# Altium project MB1404.PrjPcb (part 4 of 4)

## Sheet STLINK-V3EC.SchDoc: STLINK-V3EC
size A3; Date: Not used; ApprovedBy: Not used; CheckedBy: Not used; Author: Not used; CompanyName: STMicroelectronics; DrawnBy: Not used; Engineer: Not used; Organization: Not used; Address1: Not used; Address2: Not used; Address3: Not used; Address4: Not used; DocumentNumber: Not used; Revision: Not used; SheetNumber: 9; SheetTotal: 9; CurrentTime: Not used; CurrentDate: Not used; Time: Not used; DocumentFullPathAndName: Not used; DocumentName: Not used; ModifiedDate: Not used; ImagePath: Not used; ProjectName: Not used; Application_BuildNumber: Not used
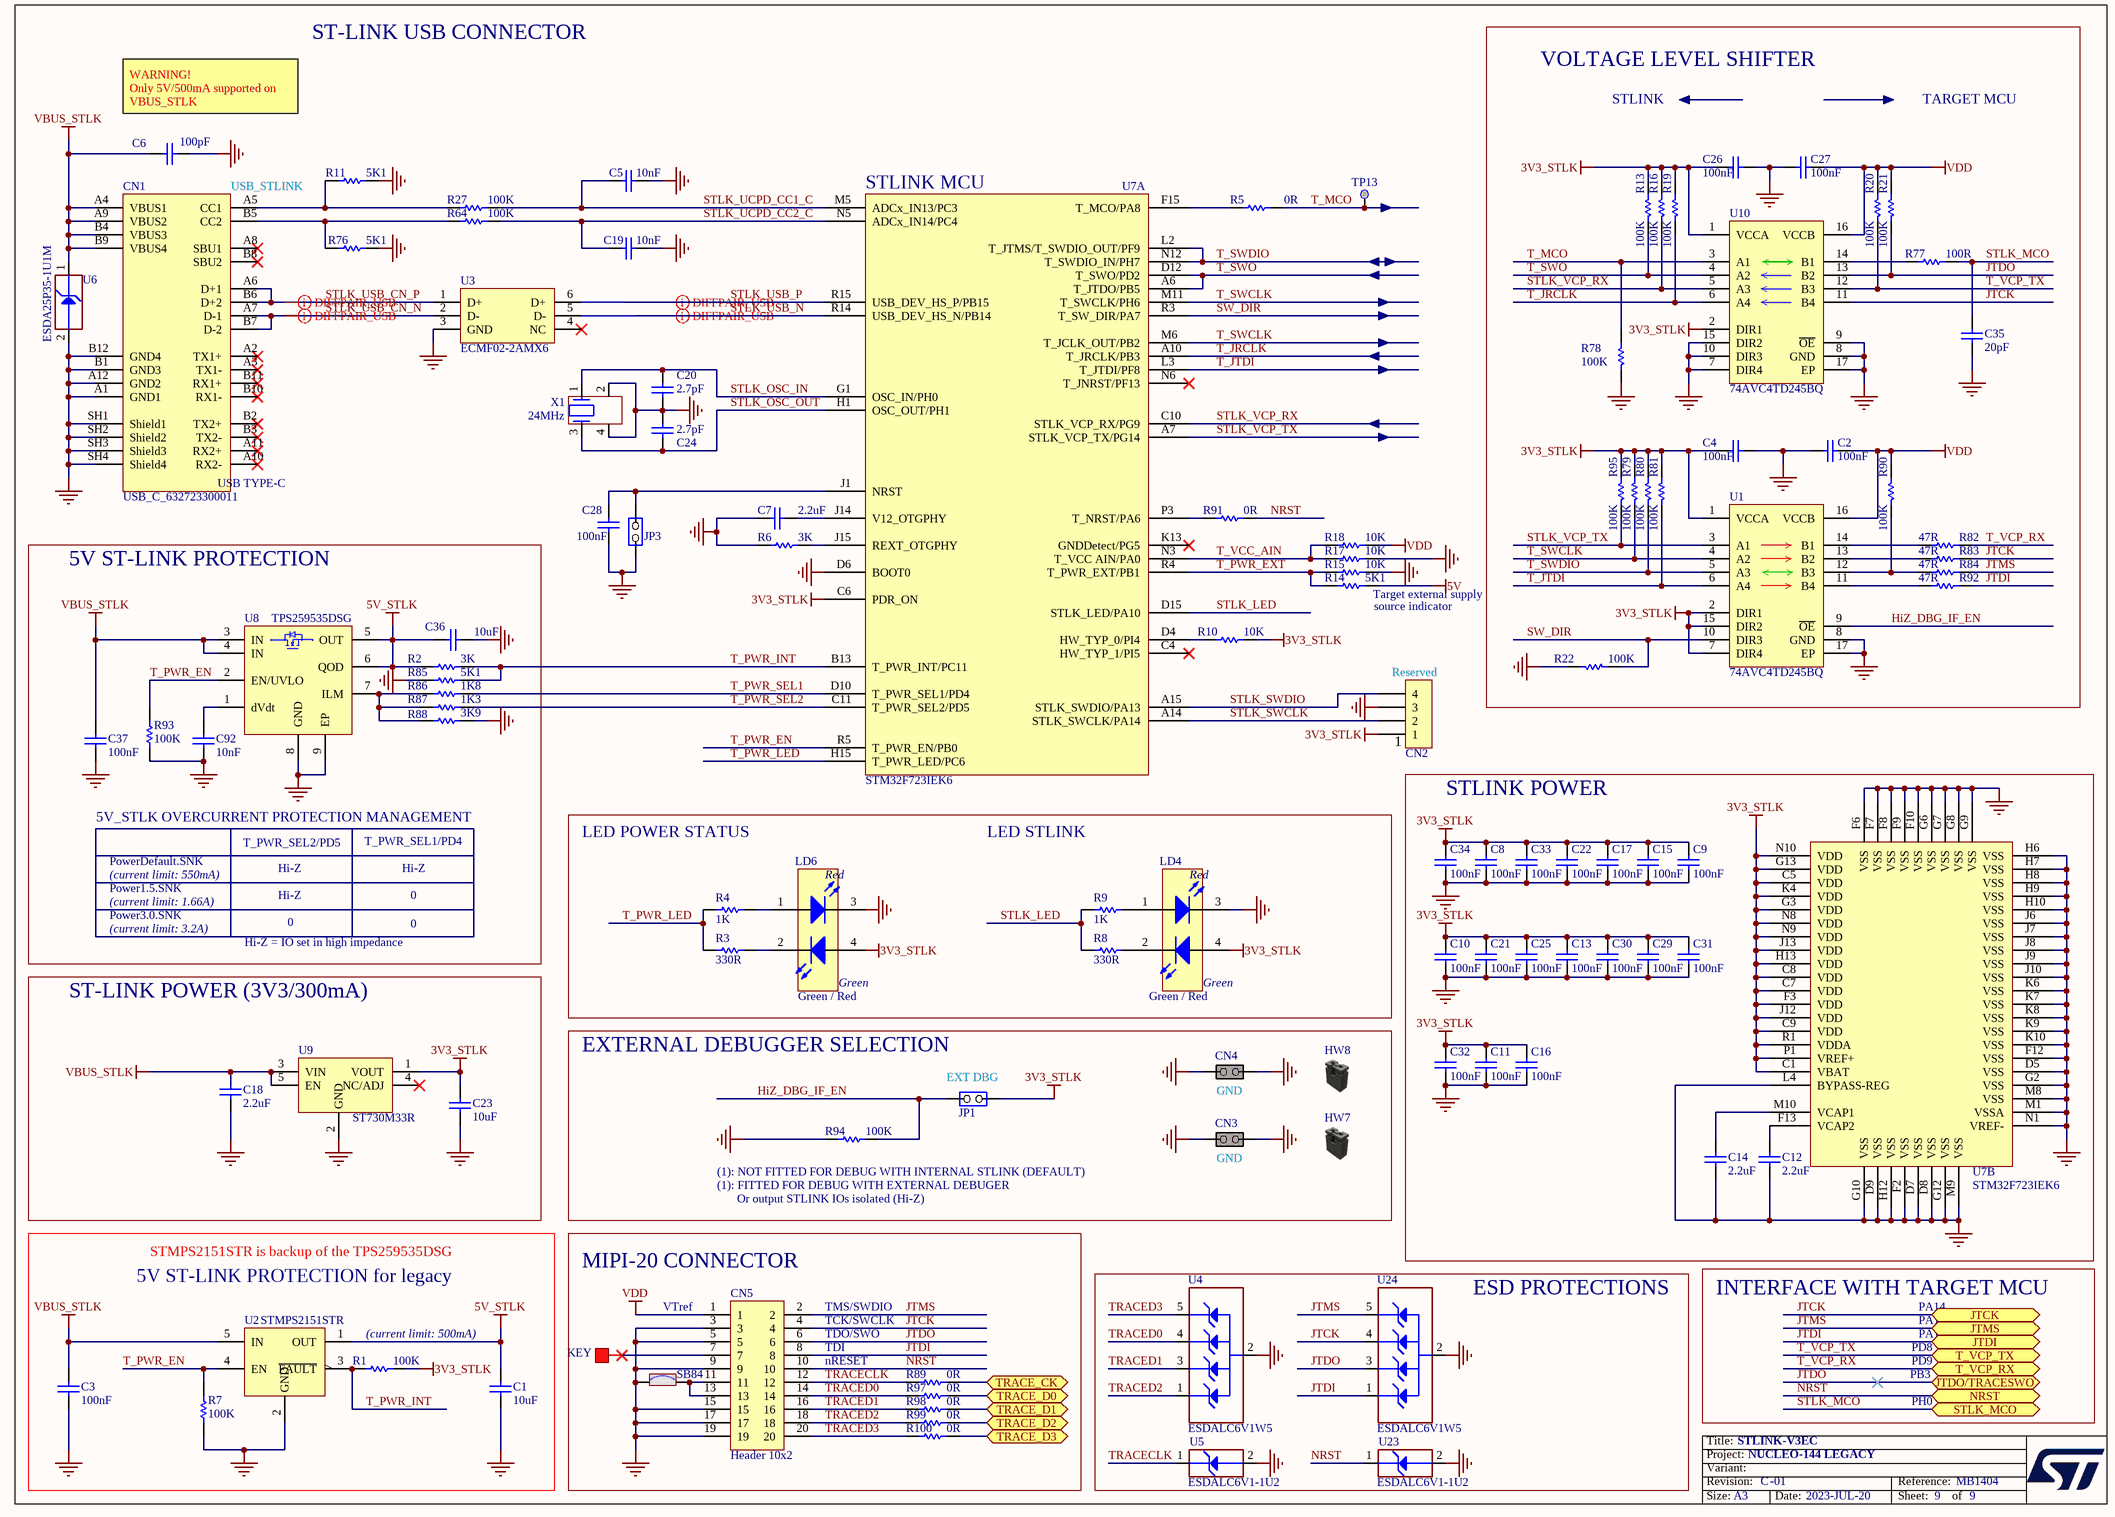
[diagram p8: STLINK-V3EC.SchDoc]

### Parts
C1  value 10uF  [C0603]  (hidden comment: Capacitor)
C2  value 100nF  [C0402]  (hidden comment: Capacitor)
C3  value 100nF  [C0402]  (hidden comment: Capacitor)
C4  value 100nF  [C0402]  (hidden comment: Capacitor)
C5  value 10nF  [C0402]  (hidden comment: Capacitor)
C6  value 100pF  [C0402]  (hidden comment: Capacitor)
C7  value 2.2uF  [C0402]  (hidden comment: Capacitor)
C8  value 100nF  [C0402]  (hidden comment: Capacitor)
C9  value 100nF  [C0402]  (hidden comment: Capacitor)
C10  value 100nF  [C0402]  (hidden comment: Capacitor)
C11  value 100nF  [C0402]  (hidden comment: Capacitor)
C12  value 2.2uF  [C0402]  (hidden comment: Capacitor)
C13  value 100nF  [C0402]  (hidden comment: Capacitor)
C14  value 2.2uF  [C0402]  (hidden comment: Capacitor)
C15  value 100nF  [C0402]  (hidden comment: Capacitor)
C16  value 100nF  [C0402]  (hidden comment: Capacitor)
C17  value 100nF  [C0402]  (hidden comment: Capacitor)
C18  value 2.2uF  [C0805]  (hidden comment: Capacitor)
C19  value 10nF  [C0402]  (hidden comment: Capacitor)
C20  value 2.7pF  [C0402]  (hidden comment: Capacitor)
C21  value 100nF  [C0402]  (hidden comment: Capacitor)
C22  value 100nF  [C0402]  (hidden comment: Capacitor)
C23  value 10uF  [C0603]  (hidden comment: Capacitor)
C24  value 2.7pF  [C0402]  (hidden comment: Capacitor)
C25  value 100nF  [C0402]  (hidden comment: Capacitor)
C26  value 100nF  [C0402]  (hidden comment: Capacitor)
C27  value 100nF  [C0402]  (hidden comment: Capacitor)
C28  value 100nF  [C0402]  (hidden comment: Capacitor)
C29  value 100nF  [C0402]  (hidden comment: Capacitor)
C30  value 100nF  [C0402]  (hidden comment: Capacitor)
C31  value 100nF  [C0402]  (hidden comment: Capacitor)
C32  value 100nF  [C0402]  (hidden comment: Capacitor)
C33  value 100nF  [C0402]  (hidden comment: Capacitor)
C34  value 100nF  [C0402]  (hidden comment: Capacitor)
C35  value 20pF  [C0402]  (hidden comment: Capacitor)
C36  value 10uF  [C0603]  (hidden comment: Capacitor)
C37  value 100nF  [C0402]  (hidden comment: Capacitor)
C92  value 10nF  [C0402]  (hidden comment: Capacitor)
CN1  value USB_C_632723300011  [CON_USB-TYPEC_WE_632723300011]  (hidden comment: USB_TYPE_C_Receptacle)
CN2  Header 4x1  [CON_SAMTEC_TSW-104-07-G-S]  (value not drawn)
CN3  Jumper_Header 2x1  [CON_SAMTEC_TSW-102-09-X-S]  (value not drawn)
CN4  Jumper_Header 2x1  [CON_SAMTEC_TSW-102-09-X-S]  (value not drawn)
CN5  Header 10x2  [CON_SAMTEC_FTSH-110-01-L-DV]
HW7  Shunt Black 2.54mm  (value not drawn)  (mechanical)
HW8  Shunt Black 2.54mm  (value not drawn)  (mechanical)
JP1  Jumper_Header 2x1  [CON_SAMTEC_TSW-102-07-G-S]  (value not drawn)
JP3  Jumper_Header 2x1  [CON_SAMTEC_TSW-102-07-G-S]  (value not drawn)
LD4  value Green / Red  [LED_BI-GR_WE-150141SV73110]  (hidden comment: LED_BICOLOR)
LD6  value Green / Red  [LED_BI-GR_WE-150141SV73110]  (hidden comment: LED_BICOLOR)
R1  value 100K  [R0402]  (hidden comment: Resistor)
R2  value 3K  [R0402]  (hidden comment: Resistor)
R3  value 330R  [R0402]  (hidden comment: Resistor)
R4  value 1K  [R0402]  (hidden comment: Resistor)
R5  value 0R  [R0402]  (hidden comment: Resistor)
R6  value 3K  [R0402]  (hidden comment: Resistor)
R7  value 100K  [R0402]  (hidden comment: Resistor)
R8  value 330R  [R0402]  (hidden comment: Resistor)
R9  value 1K  [R0402]  (hidden comment: Resistor)
R10  value 10K  [R0402]  (hidden comment: Resistor)
R11  value 5K1  [R0402]  (hidden comment: Resistor)
R13  value 100K  [R0402]  (hidden comment: Resistor)
R14  value 5K1  [R0402]  (hidden comment: Resistor)
R15  value 10K  [R0402]  (hidden comment: Resistor)
R16  value 100K  [R0402]  (hidden comment: Resistor)
R17  value 10K  [R0402]  (hidden comment: Resistor)
R18  value 10K  [R0402]  (hidden comment: Resistor)
R19  value 100K  [R0402]  (hidden comment: Resistor)
R20  value 100K  [R0402]  (hidden comment: Resistor)
R21  value 100K  [R0402]  (hidden comment: Resistor)
R22  value 100K  [R0402]  (hidden comment: Resistor)
R27  value 100K  [R0402]  (hidden comment: Resistor)
R64  value 100K  [R0402]  (hidden comment: Resistor)
R76  value 5K1  [R0402]  (hidden comment: Resistor)
R77  value 100R  [R0402]  (hidden comment: Resistor)
R78  value 100K  [R0402]  (hidden comment: Resistor)
R79  value 100K  [R0402]  (hidden comment: Resistor)
R80  value 100K  [R0402]  (hidden comment: Resistor)
R81  value 100K  [R0402]  (hidden comment: Resistor)
R82  value 47R  [R0402]  (hidden comment: Resistor)
R83  value 47R  [R0402]  (hidden comment: Resistor)
R84  value 47R  [R0402]  (hidden comment: Resistor)
R85  value 5K1  [R0402]  (hidden comment: Resistor)
R86  value 1K8  [R0402]  (hidden comment: Resistor)
R87  value 1K3  [R0402]  (hidden comment: Resistor)
R88  value 3K9  [R0402]  (hidden comment: Resistor)
R89  value 0R  [R0402]  (hidden comment: Resistor)
R90  value 100K  [R0402]  (hidden comment: Resistor)
R91  value 0R  [R0402]  (hidden comment: Resistor)
R92  value 47R  [R0402]  (hidden comment: Resistor)
R93  value 100K  [R0402]  (hidden comment: Resistor)
R94  value 100K  [R0402]  (hidden comment: Resistor)
R95  value 100K  [R0402]  (hidden comment: Resistor)
R97  value 0R  [R0402]  (hidden comment: Resistor)
R98  value 0R  [R0402]  (hidden comment: Resistor)
R99  value 0R  [R0402]  (hidden comment: Resistor)
R100  value 0R  [R0402]  (hidden comment: Resistor)
SB84  SB_ON  [SOLDER-BRIDGE_R0402-0R]  (value not drawn)
TP13  Test Point  [TP_SMD_1MM]  (value not drawn)  (no BOM)
U1  74AVC4TD245BQ  [ICC_DHVQFN16-EPAD_SOT763-1_2P5X3P5_H0P85_P050]
U2  STMPS2151STR  [MOS_SOT23-5L]
U3  ECMF02-2AMX6  [ESD_QFN-6L_1P7X1P5_P050]
U4  ESDALC6V1W5  [ESD_SOT323-5L]
U5  value ESDALC6V1-1U2  [ESD_ST0201]  (hidden comment: ESD-TRANSIL)
U6  value ESDA25P35-1U1M  [ESD_QFN1610_2N_1K_2A]  (hidden comment: ESD-TRANSIL)
U7  value STM32F723IEK6  [ICC_UFBGA201_176+25_10X10_P065]  (hidden comment: STLINK-V3EC)  (parts A,B of 3)
U8  TPS259535DSG  [ICC_WSON8-EPAD_2X2_P050]
U9  ST730M33R  [ICC_SOT23-5L_H1P45]
U10  74AVC4TD245BQ  [ICC_DHVQFN16-EPAD_SOT763-1_2P5X3P5_H0P85_P050]
U23  value ESDALC6V1-1U2  [ESD_ST0201]  (hidden comment: ESD-TRANSIL)
U24  ESDALC6V1W5  [ESD_SOT323-5L]
X1  value 24MHz  [CRY_NX2016SA_4P]  (hidden comment: XTAL_4_PINS)

### Blocks framed on the sheet
VOLTAGE LEVEL SHIFTER: C2 C4 C26 C27 C35 R13 R16 R19-R22 R77-R84 R90 R92 R95 U1 U10
5V ST-LINK PROTECTION: C36 C37 C92 R2 R85-R88 R93 U8
STLINK POWER: C8-C17 C21 C22 C25 C29-C34 U7
ST-LINK POWER (3V3/300mA): C18 C23 U9
EXTERNAL DEBUGGER SELECTION: CN3 CN4 HW7 HW8 JP1 R94
5V ST-LINK PROTECTION for legacy: C1 C3 R1 R7 U2
MIPI-20 CONNECTOR: CN5 R89 R97-R100 SB84
ESD PROTECTIONS: U4 U5 U23 U24

### Ports
JTCK (bidir), JTDI (bidir), JTDO/TRACESWO (bidir), JTMS (bidir), NRST (bidir), STLK_MCO (bidir), T_VCP_RX (bidir), T_VCP_TX (bidir), TRACE_CK (bidir), TRACE_D0 (bidir), TRACE_D1 (bidir), TRACE_D2 (bidir), TRACE_D3 (bidir)

### Nets
3V3_STLK: C4.2 C8.1 C9.1 C10.1 C11.1 C13.1 C15.1 C16.1 C17.1 C21.1 C22.1 C23.2 C25.1 C26.2 C29.1 C30.1 C31.1 C32.1 C33.1 C34.1 CN2.1 JP1.1(COMMON) LD4.4(Green_anode) LD6.4(Green_anode) R1.1 R10.2 R13.2 R16.2 R19.2 R79.1 R80.2 R81.2 R95.1 U1.1(VCCA) U1.2(DIR1) U1.7(DIR4) U1.15(DIR2) U7.C1(VBAT) U7.C5(VDD) U7.C6(PDR_ON) U7.C7(VDD) U7.C8(VDD) U7.C9(VDD) U7.F3(VDD) U7.G3(VDD) U7.G13(VDD) U7.H13(VDD) U7.J12(VDD) U7.J13(VDD) U7.K4(VDD) U7.N8(VDD) U7.N9(VDD) U7.N10(VDD) U7.P1(VREF+) U7.R1(VDDA) U9.1(VOUT) U10.1(VCCA) U10.2(DIR1)
5V: R14.2
5V_STLK: C1.2 C36.2 R2.1 U2.1(OUT) U8.5(OUT) U8.6(QOD)
GND: C1.1 C2.2 C3.1 C4.1 C5.2 C6.2 C7.1 C8.2 C9.2 C10.2 C11.2 C12.1 C13.2 C14.1 C15.2 C16.2 C17.2 C18.1 C19.2 C20.1 C21.2 C22.2 C23.1 C24.1 C25.2 C26.1 C27.2 C28.1 C29.2 C30.2 C31.2 C32.2 C33.2 C34.2 C35.2 C36.1 C37.1 C92.1 CN1.A1(GND1) CN1.A12(GND2) CN1.B1(GND3) CN1.B12(GND4) CN1.SH1(Shield1) CN1.SH2(Shield2) CN1.SH3(Shield3) CN1.SH4(Shield4) CN2.3 CN3.1(COMMON) CN3.2(NO) CN4.1(COMMON) CN4.2(NO) CN5.3 CN5.5 CN5.9 CN5.15 CN5.17 CN5.19 JP3.2(NO) LD4.3(RED_cathode) LD6.3(RED_cathode) R6.2 R7.1 R11.2 R15.2 R17.2 R22.1 R76.2 R78.1 R85.1 R88.2 R93.1 R94.1 SB84.1 U1.8(GND) U1.17(EP) U2.2(GND) U3.3(GND) U4.2(GND) U5.2(GND) U6.2(GND) U7.D5(VSS) U7.D6(BOOT0) U7.D7(VSS) U7.D8(VSS) U7.D9(VSS) U7.F2(VSS) U7.F6(VSS) U7.F7(VSS) U7.F8(VSS) U7.F9(VSS) U7.F10(VSS) U7.F12(VSS) U7.G2(VSS) U7.G6(VSS) U7.G7(VSS) U7.G8(VSS) U7.G9(VSS) U7.G10(VSS) U7.G12(VSS) U7.H6(VSS) U7.H7(VSS) U7.H8(VSS) U7.H9(VSS) U7.H10(VSS) U7.H12(VSS) U7.J6(VSS) U7.J7(VSS) U7.J8(VSS) U7.J9(VSS) U7.J10(VSS) U7.K6(VSS) U7.K7(VSS) U7.K8(VSS) U7.K9(VSS) U7.K10(VSS) U7.L4(BYPASS-REG) U7.M1(VSSA) U7.M8(VSS) U7.M9(VSS) U7.N1(VREF-) U8.8(GND) U8.9(EP) U9.2(GND) U10.7(DIR4) U10.8(GND) U10.9(~{OE}) U10.10(DIR3) U10.15(DIR2) U10.17(EP) U23.2(GND) U24.2(GND) X1.2 X1.4
VBUS_STLK: C3.2 C6.1 C18.2 C37.2 CN1.A4(VBUS1) CN1.A9(VBUS2) CN1.B4(VBUS3) CN1.B9(VBUS4) U2.5(IN) U6.1(IO1) U8.3(IN) U8.4(IN) U9.3(VIN) U9.5(EN)
VDD: C2.1 C27.1 CN5.1 R18.2 R20.2 R21.2 R90.2 U1.16(VCCB) U10.16(VCCB)
HiZ_DBG_IF_EN: JP1.2(NO) R94.2 U1.9(~{OE})
JTCK: CN5.4 R83.2 U10.11(B4) U24.4(IO3) ; port JTCK
JTDI: CN5.8 R92.2 U24.1(IO1) ; port JTDI
JTDO: CN5.6 R21.1 U10.13(B2) U24.3(IO2) ; port JTDO/TRACESWO
JTMS: CN5.2 R84.2 U24.5(IO4) ; port JTMS
NRST: CN5.10 R91.2 U23.1(IO1) ; port NRST
STLK_LED: R8.1 R9.2 U7.D15(STLK_LED/PA10)
STLK_MCO: C35.1 R77.2 ; port STLK_MCO
STLK_OSC_IN: C20.2 U7.G1(OSC_IN/PH0) X1.1
STLK_OSC_OUT: C24.2 U7.H1(OSC_OUT/PH1) X1.3
STLK_SWCLK: CN2.2 U7.A14(STLK_SWCLK/PA14)
STLK_SWDIO: CN2.4 U7.A15(STLK_SWDIO/PA13)
STLK_UCPD_CC1_C: C5.1 R27.2 U7.M5(ADCx_IN13/PC3)
STLK_UCPD_CC2_C: C19.1 R64.2 U7.N5(ADCx_IN14/PC4)
STLK_USB_CN_N: CN1.A7(D-1) CN1.B7(D-2) U3.2(D-)
STLK_USB_CN_P: CN1.A6(D+1) CN1.B6(D+2) U3.1(D+)
STLK_USB_N: U3.5(D-) U7.R14(USB_DEV_HS_N/PB14)
STLK_USB_P: U3.6(D+) U7.R15(USB_DEV_HS_P/PB15)
STLK_VCP_RX: R16.1 U7.C10(STLK_VCP_RX/PG9) U10.5(A3)
STLK_VCP_TX: R95.2 U1.3(A1) U7.A7(STLK_VCP_TX/PG14)
SW_DIR: R22.2 U1.10(DIR3) U7.R3(T_SW_DIR/PA7)
T_JRCLK: R19.1 U7.A10(T_JRCLK/PB3) U10.6(A4)
T_JTDI: R81.1 U1.6(A4) U7.L3(T_JTDI/PF8)
T_MCO: R5.2 R78.2 TP13.1 U10.3(A1)
T_PWR_EN: R7.2 R93.2 U2.4(EN) U7.R5(T_PWR_EN/PB0) U8.2(EN/UVLO)
T_PWR_EXT: R14.1 R15.1 U7.R4(T_PWR_EXT/PB1)
T_PWR_INT: R1.2 R2.2 R85.2 U2.3(~{FAULT}) U7.B13(T_PWR_INT/PC11)
T_PWR_LED: R3.2 R4.2 U7.H15(T_PWR_LED/PC6)
T_PWR_SEL1: R86.2 U7.D10(T_PWR_SEL1/PD4)
T_PWR_SEL2: R87.2 U7.C11(T_PWR_SEL2/PD5)
T_SWCLK: R79.2 U1.4(A2) U7.M6(T_JCLK_OUT/PB2) U7.M11(T_SWCLK/PH6)
T_SWDIO: R80.1 U1.5(A3) U7.L2(T_JTMS/T_SWDIO_OUT/PF9) U7.N12(T_SWDIO_IN/PH7)
T_SWO: R13.1 U7.A6(T_JTDO/PB5) U7.D12(T_SWO/PD2) U10.4(A2)
T_VCC_AIN: R17.1 R18.1 U7.N3(T_VCC_AIN/PA0)
T_VCP_RX: R82.2 ; port T_VCP_RX
T_VCP_TX: R20.1 U10.12(B3) ; port T_VCP_TX
TRACE_CK: R89.2 ; port TRACE_CK
TRACE_D0: R97.2 ; port TRACE_D0
TRACE_D1: R98.2 ; port TRACE_D1
TRACE_D2: R99.2 ; port TRACE_D2
TRACE_D3: R100.2 ; port TRACE_D3
TRACECLK: CN5.12 R89.1 U5.1(IO1)
TRACED0: CN5.14 R97.1 U4.4(IO3)
TRACED1: CN5.16 R98.1 U4.3(IO2)
TRACED2: CN5.18 R99.1 U4.1(IO1)
TRACED3: CN5.20 R100.1 U4.5(IO4)
NetC7_2: C7.2 U7.J14(V12_OTGPHY)
NetC12_2: C12.2 U7.F13(VCAP2)
NetC14_2: C14.2 U7.M10(VCAP1)
NetC28_2: C28.2 JP3.1(COMMON) U7.J1(NRST)
NetC92_2: C92.2 U8.1(dVdt)
NetCN1_A5: CN1.A5(CC1) R11.1 R27.1
NetCN1_B5: CN1.B5(CC2) R64.1 R76.1
NetCN5_11: CN5.11 CN5.13 SB84.2
NetLD4_1: LD4.1(Red_anode) R9.1
NetLD4_2: LD4.2(Green_cathode) R8.2
NetLD6_1: LD6.1(Red_anode) R4.1
NetLD6_2: LD6.2(Green_cathode) R3.1
NetR5_1: R5.1 U7.F15(T_MCO/PA8)
NetR6_1: R6.1 U7.J15(REXT_OTGPHY)
NetR10_1: R10.1 U7.D4(HW_TYP_0/PI4)
NetR77_1: R77.1 U10.14(B1)
NetR82_1: R82.1 U1.14(B1)
NetR83_1: R83.1 U1.13(B2)
NetR84_1: R84.1 R90.1 U1.12(B3)
NetR86_1: R86.1 R87.1 R88.1 U8.7(ILM)
NetR91_1: R91.1 U7.P3(T_NRST/PA6)
NetR92_1: R92.1 U1.11(B4)

Not connected (* = marked no-connect by the designer): CN1 A2(TX1+)* A3(TX1-)* A8(SBU1)* A10(RX2-)* A11(RX2+)* B2(TX2+)* B3(TX2-)* B8(SBU2)* B10(RX1-)* B11(RX1+)*; CN5 7*; U3 4(NC)*; U7 C4(HW_TYP_1/PI5)* K13(GNDDetect/PG5)* N6(T_JNRST/PF13)*; U9 4(NC/ADJ)*

### Layout directives
differential pair; rule Impedance Constraint [Min = 85.00    Max = 95.00    ]: STLK_USB_CN_N, STLK_USB_CN_P, STLK_USB_N, STLK_USB_P

### Notes on the sheet
- ST-LINK USB CONNECTOR
- (near C6) WARNING!
  Only 5V/500mA supported on VBUS_STLK
- STLINK
- TARGET MCU
- (near CN1) USB_STLINK
- (near U7) STLINK MCU
- (near R14) Target external supply
- source indicator
- (near CN2) Reserved
- (near CN2) 1
- 5V_STLK OVERCURRENT PROTECTION MANAGEMENT
- T_PWR_SEL2/PD5
- T_PWR_SEL1/PD4
- LED POWER STATUS
- LED STLINK
- (current limit: 550mA)
- (current limit: 1.66A)
- Power1.5.SNK
- Power3.0.SNK
- PowerDefault.SNK
- Hi-Z
- 0
- (current limit: 3.2A)
- Hi-Z = IO set in high impedance
- (near JP1) EXT DBG
- (near CN4) GND
- (near R94) (1): NOT FITTED FOR DEBUG WITH INTERNAL STLINK (DEFAULT)
- (near R94) (1): FITTED FOR DEBUG WITH EXTERNAL DEBUGER
- (near CN3) GND
- STMPS2151STR is backup of the TPS259535DSG
- Or output STLINK IOs isolated (Hi-Z)
- (near CN5) VTref
- (near CN5) TMS/SWDIO
- (near CN5) TCK/SWCLK
- INTERFACE WITH TARGET MCU
- PA14
- PA13
- (current limit: 500mA)
- KEY
- (near CN5) TDO/SWO
- (near CN5) TDI
- nRESET
- PB3
- PD8
- PD9
- PA15
- PH0
- Title:
- Project:
- Size:
- Revision:
- Variant:
- A3
- -
- Date:
- Reference:
- Sheet:
- of
- (in symbol MCD-02273) USB TYPE-C
- (in symbol MCD-02631) Red; Green

### Library data of the parts
C1 C23 C36 = MCD-00099: Capacitor, MLCC, 10uF, 10V, X5R, +/-10%, 0603, T=0.8mm; Part_Preference: Recommended; Manufacturer: MURATA; Manufacturer_Part_Number: GRM188R61A106KE69D; Order_Code_RS: 170-6168; Component_Country_Of_Origin: Japan; Internal_Part_Number: MCD-00099; Status: Released; Part_Type: Capacitor; Package: 0603; ComponentLink1URL: http://tunmcdsvn.tun.st.com/Component_Documentation_Library/Trunk/Capacitor/MURATA_GRM_Series; Order_Code_Digikey: 490-10474-1-ND; Order_Code_Farnell: 2494233
C2 C4 C8-C11 C13 C15-C17 C21 C22 C25-C34 = MCD-00006: Capacitor, MLCC, 100nF, 16V, X7R, 10%, 0402, T=0.5mm; Manufacturer_Part_Number: CC0402KRX7R7BB104; Manufacturer: YAGEO; Alternate_Manufacturer_Part_Number: GCM155R71C104KA55D; Alternate_Manufacturer: MURATA; Provided_By: SUBCO; Internal_Part_Number: MCD-00006; ComponentLink1Description: Datasheet; Status: Released; Package: C0402; Part_Type: Capacitor; ComponentLink1URL: http://tunmcdsvn.tun.st.com/Component_Datasheet_Library/Trunk/Capacitors/Yageo_Multilayer_Capacitor_X7R_series_100pF_to_22uF
C3 = MCD-02355: Capacitor, MLCC, 100nF, 25V, X7R, +/-10%, 0402, T=0.5mm; Part_Preference: Recommended; Manufacturer: WALSIN; Manufacturer_Part_Number: 0402B104K250CT; Order_Code_RS: 176-3114; Component_Country_Of_Origin: Unknown; ShowFields: YES; ID: 4461; Internal_Part_Number: MCD-02355; Status: Released; Part_Type: Capacitor; Package: 0402; ComponentLink1URL: http://tunmcdsvn.tun.st.com/Component_Documentation_Library/Trunk/Capacitor/WALSIN_Monolithic_Series/; Order_Code_Digikey: 1292-1175-1-ND; Order_Code_Farnell: 2496772
C5 C19 = MCD-02198: Capacitor, MLCC, 10nF, 50V, X7R, +/-10%, 0402, T=0.5mm; Part_Preference: Recommended; Manufacturer: YAGEO; Manufacturer_Part_Number: CC0402KRX7R9BB103; Order_Code_RS: 6169644; Component_Country_Of_Origin: China; Internal_Part_Number: MCD-02198; Status: Checked; Part_Type: Capacitor; Package: 0402; ComponentLink1URL: http://tunmcdsvn.tun.st.com/Component_Documentation_Library/Trunk/Capacitor/YAGEO_X7R_Series; Order_Code_Digikey: N/A; Order_Code_Farnell: N/A
C6 = MCD-00205: Capacitor, MLCC, 100pF, 50V, NPO, +/-5%, 0402, T=0.5mm; Part_Preference: Recommended; Manufacturer: YAGEO; Manufacturer_Part_Number: CC0402JRNPO9BN101; Component_Country_Of_Origin: China; Internal_Part_Number: MCD-00205; Status: Released; Part_Type: Capacitor; Package: 0402; ComponentLink1URL: http://tunmcdsvn.tun.st.com/Component_Documentation_Library/Trunk/Capacitor/YAGEO_NP0_Series; Order_Code_Digikey: 311-1024-1-ND; Order_Code_Farnell: 3019226RL; Order_Code_RS: N/A
C7 C12 C14 = MCD-02606: Capacitor, MLCC, 2.2uF, 6.3V, X5R, +/-10%, 0402, T=0.5mm; Part_Preference: Recommended; Manufacturer: YAGEO; Manufacturer_Part_Number: CC0402KRX5R5BB225; Order_Code_RS: 1992205; Internal_Part_Number: MCD-02606; Status: New; Part_Type: Capacitor; Package: 0402; ComponentLink1URL: http://tunmcdsvn.tun.st.com/Component_Documentation_Library/Trunk/Capacitor/YAGEO_X5R_Series; Order_Code_Digikey: 311-1682-2-ND; Order_Code_Farnell: 3366429
C18 = MCD-02372: Capacitor, MLCC, 2.2uF, 25V, X7R, +/-10%, 0805, T=1,25mm; Manufacturer_Part_Number: GRM21BR71E225KE11L; Manufacturer: MURATA; Part_Preference: Recommended; ECCN_US: EAR99; ECCN_EU: NEC; Provided_By: SUBCO; Internal_Part_Number: MCD-02372; Status: Checked; Part_Type: Capacitor; Alternate_Manufacturer_Part_Number: N/A; Alternate_Manufacturer: N/A; Package: C0805; ComponentLink1Description: Datasheet; ComponentLink1URL: http://tunmcdsvn.tun.st.com/Component_Documentation_Library/Trunk/Capacitor/MURATA_GRM_Series/GRM21BR71E225KE11; Order_Code_Digikey: 490-14467; Order_Code_Farnell: 2688538; Order_Code_RS: N/A
C20 C24 = MCD-01774: Capacitor, MLCC, 2.7pF, 50V, NPO, +/-0.1pF, 0402, T=0.5mm; Part_Preference: Recommended; Manufacturer: YAGEO; Manufacturer_Part_Number: CC0402BRNPO9BN2R7; Component_Country_Of_Origin: China; Internal_Part_Number: MCD-01774; Status: Released; Part_Type: Capacitor; Package: 0402; ComponentLink1URL: http://tunmcdsvn.tun.st.com/Component_Documentation_Library/Trunk/Capacitor/YAGEO_NP0_Series; Order_Code_Digikey: 311-1619-1-ND; Order_Code_Farnell: N/A; Order_Code_RS: N/A
C35 = MCD-00016: Capacitor, MLCC, 20pF, 50V, NPO, 5%, 0402, T=0,5mm; Manufacturer_Part_Number: CC0402JRNPO9BN200; Manufacturer: YAGEO; Provided_By: SUBCO; Internal_Part_Number: MCD-00016; Status: Released; Package: C0402; ComponentLink1Description: Datasheet; Part_Type: Capacitor; ComponentLink1URL: http://tunmcdsvn.tun.st.com/Component_Datasheet_Library/Trunk/Capacitors/Yageo_Capacitor_NP0_16V-to-50V
C37 = MCD-02355: Capacitor, MLCC, 100nF, 25V, X7R, +/-10%, 0402, T=0.5mm; Part_Preference: Recommended; Manufacturer: WALSIN; Manufacturer_Part_Number: 0402B104K250CT; Order_Code_RS: 176-3114; Component_Country_Of_Origin: Unknown; Internal_Part_Number: MCD-02355; Status: Checked; Part_Type: Capacitor; Package: 0402; ComponentLink1URL: http://tunmcdsvn.tun.st.com/Component_Documentation_Library/Trunk/Capacitor/WALSIN_Monolithic_Series/; Order_Code_Digikey: 1292-1175-1-ND; Order_Code_Farnell: 2496772
C92 = MCD-02198: Capacitor, MLCC, 10nF, 50V, X7R, +/-10%, 0402, T=0.5mm; Part_Preference: Recommended; Manufacturer: YAGEO; Manufacturer_Part_Number: CC0402KRX7R9BB103; Order_Code_RS: 6169644; Component_Country_Of_Origin: China; ShowFields: YES; ID: 4298; Internal_Part_Number: MCD-02198; Status: Checked; Part_Type: Capacitor; Package: 0402; ComponentLink1URL: http://tunmcdsvn.tun.st.com/Component_Documentation_Library/Trunk/Capacitor/YAGEO_X7R_Series; Order_Code_Digikey: N/A; Order_Code_Farnell: N/A
CN1 = MCD-02273: Connector_USB_TypeC, 24pins, RA, TH, T=1.9mm (USB certified); Part_Preference: Recommended; Manufacturer: WURTH ELEKTRONIK; Manufacturer_Part_Number: 632723300011; Component_Country_Of_Origin: China; ShowFields: YES; ID: 4373; Internal_Part_Number: MCD-02273; Status: Released; Part_Type: Connector; ComponentLink1URL: http://tunmcdsvn.tun.st.com/Component_Datasheet_Library/Trunk/Connectors/WURTH_ELEKTRONIK_USB_TYPE-C_632723300011; Order_Code_Digikey: 732-9618-1-ND; Order_Code_Farnell: 2984404; Order_Code_RS: N/A
CN2 = MCD-00029: Header, 4x1, 2,54mm, VR, TH, Height 5.84mm/2.54mm; Manufacturer_Part_Number: TSW-104-07-x-S; Manufacturer: SAMTEC; Part_Type: Connector; Provided_By: SUBCO; Internal_Part_Number: MCD-00029; Status: Released; ComponentLink1Description: Datasheet; ComponentLink1URL: http://tunmcdsvn.tun.st.com/Component_Datasheet_Library/Trunk/Connectors/Samtec_TSW-HTSW-series
CN3 CN4 = MCD-00214: Header, 2x1, 2,54mm, VR, TH, Height 5.84mm/10.16mm; Manufacturer_Part_Number: TSW-102-09-x-S; Manufacturer: SAMTEC; Part_Type: Connector; Value: Header 2x1 16mm; Provided_By: SUBCO; Internal_Part_Number: MCD-00214; ComponentLink1Description: Datasheet; Status: Released; ComponentLink1URL: http://tunmcdsvn.tun.st.com/Component_Datasheet_Library/Trunk/Connectors/Samtec_TSW-HTSW-series; ECCN_US: n/a; ECCN_EU: n/a
CN5 = MCD-00557: Header, 10x2, 1.27mm, VR, SMD, T=3.05mm; BMS_Part_Number: 9183690; Part_Type: Connector; Part_Preference: Recommended; Manufacturer: SAMTEC; Manufacturer_Part_Number: FTSH-110-01-L-DV; Order_Code_RS: 767-6774; Component_Country_Of_Origin: China, Costa Rica, Malaysia, United States, Vietnam; ShowFields: YES; ID: 3188; Internal_Part_Number: MCD-00557; Value: Header 10x2; Status: Released; ComponentLink1URL: http://tunmcdsvn.tun.st.com/Component_Documentation_Library/Trunk/Connector/SAMTEC_FTSH_Series/; Order_Code_Digikey: SAM1161-10-ND; Order_Code_Farnell: 1667761
HW7 HW8 = MCD-00043: SHUNT 2.54mm BLACK; Manufacturer_Part_Number: SNT-100-BK-G; Manufacturer: SAMTEC; Part_Type: Mechanical; Alternate_Manufacturer_Part_Number: 316102S111A; Alternate_Manufacturer: JIUBABA; Provided_By: SUBCO; Value: SNT-100-BK-G; Internal_Part_Number: MCD-00043; ComponentLink1Description: Datasheet; Status: Released; ComponentLink1URL: http://tunmcdsvn.tun.st.com/Component_Datasheet_Library/Trunk/Connectors/Samtec_Shunt_Jumper_SNT100; ECCN_US: n/a; ECCN_EU: n/a
JP1 JP3 = MCD-00045: Header, 2x1, 2,54mm, VR, TH, Height 5.84mm/2.54mm; Part_Preference: Recommended; Part_Type: Connector; Manufacturer: SAMTEC; Manufacturer_Part_Number: TSW-102-07-G-S; Alternate_Manufacturer: JIUBABA; LIANYI; Alternate_Manufacturer_Part_Number: 313102S111116;313102S111116; Internal_Part_Number: MCD-00045; Status: Released; ComponentLink1Description: Datasheet; ComponentLink1URL: http://tunmcdsvn.tun.st.com/Component_Datasheet_Library/Trunk/Connectors/Samtec_TSW-HTSW-series
LD4 LD6 = MCD-02631: LED Bicolor, Green/Red, 2V, 20mA,  4-PLCC; Part_Type: Display; Part_Preference: Recommended; Manufacturer: WURTH ELEKTRONIK; Manufacturer_Part_Number: 150141SV73110; Order_Code_RS: 184-6963; Internal_Part_Number: MCD-02631; Status: Checked; Package: 4-PLCC; ComponentLink1URL: http://tunmcdsvn.tun.st.com/Component_Documentation_Library/Trunk/Display/WURTH_ELEKTRONIK_150141SV73110; Order_Code_Digikey: 732-13404-2-ND; Order_Code_Farnell: 2990869
R1 R7 = MCD-00059: Resistor,100K,0402,1%,1/16W; Manufacturer_Part_Number: RC0402FR-07100KL; Manufacturer: YAGEO; Alternate_Manufacturer_Part_Number: RT0402FRE07100KL; Provided_By: SUBCO; Initial_Board_Reference: MB1274; Item Type: Item; Path: ws/MCD_ApplicationBoards/Lists/MCDPARTSdatabase; Internal_Part_Number: MCD-00059; Status: Released; Part_Type: Resistor; Alternate_Manufacturer: YAGEO; Package: R0402; ComponentLink1Description: Datasheet; ComponentLink1URL: http://tunmcdsvn.tun.st.com/Component_Datasheet_Library/Trunk/Resistors/Yageo_Resistor_RC0402-series
R2 = MCD-00185: Resistor, 3K, 0402, +/-1%, 1/16W; Part_Preference: Recommended; Manufacturer: YAGEO; Manufacturer_Part_Number: RC0402FR-073KL; Component_Country_Of_Origin: China; ShowFields: YES; ID: 2682; Internal_Part_Number: MCD-00185; Status: Released; Part_Type: Resistor; Package: 0402; ComponentLink1URL: http://tunmcdsvn.tun.st.com/Component_Documentation_Library/Trunk/Resistor/YAGEO_RC_L_Series; Order_Code_Digikey: 311-3KLRCT-ND; Order_Code_Farnell: 1458777; Order_Code_RS: N/A
R3 R8 = MCD-00062: Resistor, 330R, 0402, +/-1%, 1/16W; Part_Preference: Recommended; Manufacturer: YAGEO; Manufacturer_Part_Number: RC0402FR-07330RL; Component_Country_Of_Origin: China; Internal_Part_Number: MCD-00062; Status: Released; Part_Type: Resistor; Package: 0402; ComponentLink1URL: http://tunmcdsvn.tun.st.com/Component_Documentation_Library/Trunk/Resistor/YAGEO_RC_L_Series; Order_Code_Digikey: 311-330LRCT-ND; Order_Code_Farnell: 9239170; Order_Code_RS: N/A
R4 R9 = MCD-02665: Resistor, 1K, 0402, +/-0.1%, 1/16W, +/-25ppm/°C; Part_Preference: Recommended; Manufacturer: YAGEO; Manufacturer_Part_Number: RT0402BRD071KL; Order_Code_RS: 199-1298; Internal_Part_Number: MCD-02665; Status: Checked; Part_Type: Resistor; Package: 0402; ComponentLink1URL: http://tunmcdsvn.tun.st.com/Component_Documentation_Library/Trunk/Resistor/YAGEO_RT_Series; Order_Code_Digikey: YAG1386TR-ND; Order_Code_Farnell: 3496475
R5 R91 = MCD-00052: Resistor, 0R, 0402, +/-5%, 1/16W; Part_Preference: Recommended; Manufacturer: YAGEO; Manufacturer_Part_Number: RC0402JR-070RL; Order_Code_RS: 618-5804; Component_Country_Of_Origin: China; Internal_Part_Number: MCD-00052; Status: Released; Part_Type: Resistor; Package: 0402; ComponentLink1URL: http://tunmcdsvn.tun.st.com/Component_Documentation_Library/Trunk/Resistor/YAGEO_RC_L_Series; Order_Code_Digikey: 311-0.0JRCT-ND; Order_Code_Farnell: 9232516RL
R6 = MCD-00185: Resistor,3K,0402,1%,1/16W; Manufacturer_Part_Number: RC0402FR-073KL; Manufacturer: YAGEO; Provided_By: SUBCO; Internal_Part_Number: MCD-00185; Status: Released; ComponentLink1Description: Datasheet; Part_Type: Resistor; ComponentLink1URL: http://tunmcdsvn.tun.st.com/Component_Datasheet_Library/Trunk/Resistors/Yageo_Resistor_RC0402-series; Package: R0402
R10 = MCD-00053: Resistor,10K,0402,1%,1/16W; Manufacturer_Part_Number: RC0402FR-0710KL; Manufacturer: YAGEO; Provided_By: SUBCO; Internal_Part_Number: MCD-00053; Status: Released; ComponentLink1Description: Datasheet; Part_Type: Resistor; ComponentLink1URL: http://tunmcdsvn.tun.st.com/Component_Datasheet_Library/Trunk/Resistors/Yageo_Resistor_RC0402-series; Package: R0402
R11 R76 = MCD-00333: Resistor, 5K1, 0402, +/-1%, 1/16W; Part_Preference: Recommended; Manufacturer: YAGEO; Manufacturer_Part_Number: RC0402FR-075K1L; Internal_Part_Number: MCD-00333; Status: Released; Part_Type: Resistor; Alternate_Manufacturer: N/A; Alternate_Manufacturer_Part_Number: N/A; Package: 0402; ComponentLink1URL: http://tunmcdsvn.tun.st.com/Component_Documentation_Library/Trunk/Resistor/YAGEO_RC_L_Series; Order_Code_Digikey: 311-5.10KLRCT-ND; Order_Code_Farnell: 1458805; Order_Code_RS: N/A
R13 R16 R19-R22 R78-R81 R90 R95 = MCD-00059: Resistor,100K,0402,1%,1/16W; Manufacturer_Part_Number: RC0402FR-07100KL; Manufacturer: YAGEO; Alternate_Manufacturer_Part_Number: RT0402FRE07100KL; Provided_By: Subcon; Initial_Board_Reference: MB1274; Internal_Part_Number: MCD-00059; Status: Released; ComponentLink1Description: Yageo_Resistor_RC0402-series.pdf; ECCN_US: n/a; ECCN_EU: n/a; Alternate_Manufacturer: YAGEO; Part_Type: Resistor; Package: R0402; ComponentLink1URL: http://tunmcdsvn.tun.st.com/Component_Datasheet_Library/Trunk/Resistors/Yageo_Resistor_RC0402-series
R14 R85 = MCD-00333: Resistor, 5K1, 0402, +/-1%, 1/16W; Part_Preference: Recommended; Manufacturer: YAGEO; Manufacturer_Part_Number: RC0402FR-075K1L; Component_Country_Of_Origin: China; ShowFields: YES; ID: 2944; Internal_Part_Number: MCD-00333; Status: Released; Part_Type: Resistor; Package: 0402; ComponentLink1URL: http://tunmcdsvn.tun.st.com/Component_Documentation_Library/Trunk/Resistor/YAGEO_RC_L_Series; Order_Code_Digikey: 311-5.10KLRCT-ND; Order_Code_Farnell: 1458805; Order_Code_RS: N/A
R15 R17 R18 = MCD-00053: Resistor, 10K, 0402, +/-1%, 1/16W; BMS_Part_Number: 9131590; Part_Preference: Recommended; Manufacturer: YAGEO; Manufacturer_Part_Number: RC0402FR-0710KL; Component_Country_Of_Origin: China; ShowFields: YES; ID: 2539; Internal_Part_Number: MCD-00053; Status: Released; Part_Type: Resistor; Package: 0402; ComponentLink1URL: http://tunmcdsvn.tun.st.com/Component_Documentation_Library/Trunk/Resistor/YAGEO_RC_L_Series; Order_Code_Digikey: 311-10.0KLRCT-ND; Order_Code_Farnell: 9239359; Order_Code_RS: N/A
R27 R64 R93 R94 = MCD-00059: Resistor, 100K, 0402, +/-1%, 1/16W; Part_Preference: Recommended; Manufacturer: YAGEO; Manufacturer_Part_Number: RC0402FR-07100KL; Component_Country_Of_Origin: China; ShowFields: YES; ID: 2533; Internal_Part_Number: MCD-00059; Status: Released; Part_Type: Resistor; Package: 0402; ComponentLink1URL: http://tunmcdsvn.tun.st.com/Component_Documentation_Library/Trunk/Resistor/YAGEO_RC_L_Series; Order_Code_Digikey: 311-100KLRTR-ND; Order_Code_Farnell: 2421891; Order_Code_RS: N/A
R77 = MCD-00067: Resistor, 100R, 0402, +/- 1%, 1/16W; Part_Preference: Recommended; Manufacturer: YAGEO; Manufacturer_Part_Number: RC0402FR-07100RL; Component_Country_Of_Origin: China; ShowFields: YES; ID: 2527; Internal_Part_Number: MCD-00067; Status: Released; Part_Type: Resistor; Package: 0402; ComponentLink1URL: http://tunmcdsvn.tun.st.com/Component_Documentation_Library/Trunk/Resistor/YAGEO_RC_L_Series; Order_Code_Digikey: 311-100LRCT-ND; Order_Code_Farnell: 9239111; Order_Code_RS: N/A
R82-R84 R92 = MCD-00481: Resistor,47R,0402,1%,1/16W; Manufacturer_Part_Number: RC0402FR-0747RL; Manufacturer: YAGEO; Provided_By: SUBCO; Initial_Board_Reference: MBxxxx; Internal_Part_Number: MCD-00481; Status: Released; Part_Type: Resistor; Package: R0402; ComponentLink1Description: Datasheet; ComponentLink1URL: http://tunmcdsvn.tun.st.com/Component_Datasheet_Library/Trunk/Resistors/Yageo_Resistor_RC0402-series
R86 = MCD-00409: Resistor, 1K8, 0402, +/-1%, 1/16W; Part_Preference: Recommended; Manufacturer: YAGEO; Manufacturer_Part_Number: RC0402FR-071K8L; Component_Country_Of_Origin: China; Internal_Part_Number: MCD-00409; Status: Released; Part_Type: Resistor; Package: 0402; ComponentLink1URL: http://tunmcdsvn.tun.st.com/Component_Documentation_Library/Trunk/Resistor/YAGEO_RC_L_Series; Order_Code_Digikey: 311-1.80KLRCT-ND; Order_Code_Farnell: 9239260; Order_Code_RS: N/A
R87 = MCD-00381: Resistor, 1K3, 0402, +/-1%, 1/16W; Part_Preference: Recommended; Manufacturer: YAGEO; Manufacturer_Part_Number: RC0402FR-071K3L; Component_Country_Of_Origin: China; ShowFields: YES; ID: 2898; Internal_Part_Number: MCD-00381; Status: Released; Part_Type: Resistor; Package: 0402; ComponentLink1URL: http://tunmcdsvn.tun.st.com/Component_Documentation_Library/Trunk/Resistor/YAGEO_RC_L_Series; Order_Code_Digikey: YAG3036CT-ND; Order_Code_Farnell: 1799176; Order_Code_RS: N/A
R88 = MCD-02455: Resistor, 3K9, 0402, +/-1%, 1/16W, +/-100ppm/°C; Part_Preference: Recommended; Manufacturer: YAGEO; Manufacturer_Part_Number: RC0402FR-073K9L; Order_Code_RS: 198-7783; Component_Country_Of_Origin: China; ShowFields: YES; ID: 4561; Internal_Part_Number: MCD-02455; Status: Released; Part_Type: Resistor; Package: 0402; ComponentLink1URL: http://tunmcdsvn.tun.st.com/Component_Documentation_Library/Trunk/Resistor/YAGEO_RC0402_Series; Order_Code_Digikey: 311-3.90KLRTR-ND; Order_Code_Farnell: 9239308
R89 R97-R100 = MCD-00052: Resistor,0R,0402,5%,1/16W; Manufacturer_Part_Number: RC0402JR-070RL; Manufacturer: YAGEO; Provided_By: SUBCO; ECCN_US: EAR99; ECCN_EU: NEC; Internal_Part_Number: MCD-00052; Status: Released; Part_Type: Resistor; Package: R0402; ComponentLink1Description: Datasheet; ComponentLink1URL: http://tunmcdsvn.tun.st.com/Component_Datasheet_Library/Trunk/Resistors/Yageo_Resistor_RC0402-series
SB84 = MCD-01618: Solder Bridge 0402 ON; Part_Type: Mechanical; Manufacturer_Part_Number: RC0402JR-070RL; Manufacturer: YAGEO; Provided_By: SUBCO; Internal_Part_Number: MCD-01618; Status: Footprint available; Package: SB0402; ComponentLink1Description: Datasheet; ComponentLink1URL: http://tunmcdsvn.tun.st.com/Component_Datasheet_Library/Trunk/Resistors/Yageo_Resistor_RC0402-series; ECCN_US: n/a; ECCN_EU: n/a
TP13 = MCD-00074: Test Point 1mm; Part_Type: Mechanical; Internal_Part_Number: MCD-00074; Status: Released; Provided_By: n/a; Manufacturer_Part_Number: n/a; Manufacturer: n/a; ComponentLink1Description: Datasheet; ComponentLink1URL: http://na
U1 U10 = MCD-01945: 4-bit dual supply translating transceiver with configurable voltage translation; 3-state; Part_Type: IC; Manufacturer_Part_Number: 74AVC4TD245BQ,115; Manufacturer: NEXPERIA; Part_Preference: Recommended; Internal_Part_Number: MCD-01945; Value: 74AVC4TD245BQ; Status: Released; Package: DHVQFN16; ComponentLink1URL: http://tunmcdsvn.tun.st.com/Component_Datasheet_Library/Trunk/IC/NEXPERIA_dual supply transceiver_74AVC4TD245; Order_Code_Digikey: 1727-6899-1-ND; Order_Code_Farnell: N/A; Order_Code_RS: N/A; Alternate_Manufacturer: N/A
U2 = MCD-00159: 500mA, Enhanced single channel power switches with active high enable pin; Part_Type: IC; Manufacturer: STMICROELECTRONICS; Alternate_Manufacturer_Part_Number: TPS2051C; Alternate_Manufacturer: TEXAS INSTRUMENTS; BMS_Part_Number: 9159009; Provided_By: Subcon; Initial_Board_Reference: MB1264; Internal_Part_Number: MCD-00159; Value: STMPS2151STR; Status: Checked; Manufacturer_Part_Number: STMPS2151STR; ComponentLink1Description: Datasheet; ComponentLink1URL: http://tunmcdsvn.tun.st.com/Component_Datasheet_Library/Trunk/IC/STM_PWR-Switch_STMPS2151STR
U3 = MCD-00649: Common mode filter with ESD protection for USB 2.0 interface; BMS_Part_Number: 9151138; Part_Type: Diode; Part_Preference: Recommended; Manufacturer: STMICROELECTRONICS; Manufacturer_HQ_COO: EU; Component_Country_Of_Origin: China; ShowFields: YES; ID: 3094; Internal_Part_Number: MCD-00649; Value: ECMF02-2AMX6; Status: Released; Manufacturer_Part_Number: ECMF02-2AMX6; ComponentLink1URL: http://tunmcdsvn.tun.st.com/Component_Datasheet_Library/Trunk/Diodes/STM_ESD_ECMF02-2AMX6
U4 U24 = MCD-00136: Dual Transil array for ESD protection; BMS_Part_Number: 9151112; Part_Type: Diode; Part_Preference: Recommended; Manufacturer: STMICROELECTRONICS; Manufacturer_HQ_COO: EU; Component_Country_Of_Origin: China; Internal_Part_Number: MCD-00136; Value: ESDALC6V1W5; Status: Released; Manufacturer_Part_Number: ESDALC6V1W5; ComponentLink1URL: http://tunmcdsvn.tun.st.com/Component_Datasheet_Library/Trunk/Diodes/STM_ESD_ESDALC6V1W5
U5 U23 = MCD-00170: ESD protection 6V1; BMS_Part_Number: 9151132; Part_Type: Diode; Part_Preference: Recommended; Manufacturer: STMICROELECTRONICS; Manufacturer_HQ_COO: EU; Component_Country_Of_Origin: China; ShowFields: YES; ID: 2696; Internal_Part_Number: MCD-00170; Status: Released; Manufacturer_Part_Number: ESDALC6V1-1U2; ComponentLink1URL: http://tunmcdsvn.tun.st.com/Component_Datasheet_Library/Trunk/Diodes/STM_ESD_ESDALC6V1-1U2
U6 = MCD-01207: High power Transient voltage suppressor:25V/35A EOS and ESD transients protection.; Part_Type: Diode; Manufacturer: STMICROELECTRONICS; BMS_Part_Number: 9179045; ECCN_US: EAR99; ECCN_EU: NEC; Provided_By: SUBCO with ST control; Internal_Part_Number: MCD-01207; Status: Checked; Manufacturer_Part_Number: ESDA25P35-1U1M; Package: QFN1610; ComponentLink1Description: Datasheet; ComponentLink1URL: http://tunmcdsvn.tun.st.com/Component_Datasheet_Library/Trunk/Diodes/STM_ESD_ESDA25P35-1U1M
U7 = MCD-02706: MCU, Arm Cortex-M7 32-bit MCU, 512KB Flash, 276KB RAM, With Crypto; BMS_Part_Number: 9175300; Part_Type: IC; Part_Preference: Recommended; Manufacturer: STMICROELECTRONICS; Order_Code_RS: 135-8241; ShowFields: YES; ID: 4812; Internal_Part_Number: MCD-02706; Status: Checked; Manufacturer_Part_Number: STM32F723IEK6; Package: BGA176; ComponentLink1URL: http://tunmcdsvn.tun.st.com/Component_Documentation_Library/IC/STMICROELECTRONICS_STM32F723IEK6; Order_Code_Digikey: 497-17186-ND; Order_Code_Farnell: 2725149
U8 = MCD-02532: eFuse with Fast Overvoltage Protection 2.7V to 18V 4A 34mOhm 8-Pin WSON; Part_Type: IC; Part_Preference: Recommended; Manufacturer: TEXAS INSTRUMENTS; Order_Code_RS: NA; Internal_Part_Number: MCD-02532; Value: TPS259535DSG; Status: New; Manufacturer_Part_Number: TPS259535DSG; Package: WSON8; ComponentLink1URL: http://tunmcdsvn.tun.st.com/Component_Datasheet_Library/Trunk/IC/TI_eFuse_tps2595/TI_eFuse_tps2595.pdf; Order_Code_Digikey: N/A; Order_Code_Farnell: NA
U9 = MCD-02514: LDO, 3.3V, 300mA, High input voltage: 2.5V to 28V, SOT23-5L; Part_Type: IC; Part_Preference: Recommended; Manufacturer: STMICROELECTRONICS; Internal_Part_Number: MCD-02514; Value: ST730M33R; BMS_Part_Number: N/A; Status: New; Manufacturer_Part_Number: ST730M33R; Alternate_Manufacturer: N/A; Alternate_Manufacturer_Part_Number: N/A; Package: SOT23-5L; ComponentLink1URL: http://tunmcdsvn.tun.st.com/Component_Documentation_Library/Trunk/IC/STMICROELECTRONICS_ST730M33R; Order_Code_Digikey: N/A; Order_Code_Farnell: N/A; Order_Code_RS: N/A
X1 = MCD-01036: Crystal, 24MHz, 6pF, +/-20ppm, 80R, 2x1.6mm; BMS_Part_Number: 9157045; Part_Type: Crystal_Osc; Part_Preference: Recommended; Manufacturer: NDK; Manufacturer_Part_Number: NX2016SA-24MHZ-EXS00A-CS10820; Component_Country_Of_Origin: Unknown; Internal_Part_Number: MCD-01036; Status: Released; Package: 2x1.6mm; ComponentLink1URL: http://tunmcdsvn.tun.st.com/Component_Documentation_Library/Trunk/Crytal_Oscillator/NDK_NX2016SA_Series; Order_Code_Digikey: 644-1365; Order_Code_Farnell: N/A; Order_Code_RS: N/A

## Nets that join several sheets
3V3: Connectors (6 pins), USB (R63.2), Ethernet (L1.2), STM32_microcontroller_power (SB26.1), Board_power (JP4.1 SB1.2 SB11.1 TP1.1)
5V: Connectors (CN8.9 CN11.18), Board_power (9 pins), STLINK-V3EC (R14.2)
5V_EXT: Connectors (CN11.6), Board_power (JP2.5)
5V_STLK: Connectors (CN12.8), Board_power (JP2.1), STLINK-V3EC (6 pins)
5V_UCPD: USB (7 pins), Board_power (JP2.9)
5V_VIN: Connectors (R96.2), Board_power (C41.2 JP2.3 U12.2 U12.4)
AGND: Connectors (C66.1 CN10.3 CN12.32), STM32_microcontroller_power (6 pins)
GND: Connectors (30 pins), USB (21 pins), Ethernet (22 pins), STM32_microcontroller_power (29 pins), Board_power (15 pins), STM32_microcontroller_IOs (14 pins), STLINK-V3EC (133 pins)
VBAT: Connectors (CN11.33), STM32_microcontroller_power (C62.2 SB55.1 U14.6)
VBUS_STLK: Board_power (JP2.7), STLINK-V3EC (14 pins)
VDD: Connectors (CN11.5 SB16.1), USB (R50.1 U18.12), Ethernet (7 pins), STM32_microcontroller_power (JP5.1), Board_power (JP4.2), STM32_microcontroller_IOs (B1.1 B1.2), STLINK-V3EC (9 pins)
VDDA: Connectors (CN10.1), STM32_microcontroller_power (6 pins)
VIN: Connectors (CN8.15 CN11.24), Board_power (C42.2 U12.3)
VREFP: Connectors (C66.2 SB46.2), STM32_microcontroller_power (C61.2 C65.1 R32.2 U14.32)
ARD_D0_RX: Connectors (CN10.16), STM32_microcontroller_IOs (SB63.2 SB65.1)
ARD_D1_TX: Connectors (CN10.14), STM32_microcontroller_IOs (SB14.1 SB23.2)
BOOT0: Connectors (CN11.7), STM32_microcontroller_IOs (R31.1 U14.138)
NRST: Connectors (CN8.5 CN11.14), Ethernet (SB72.1), STM32_microcontroller_IOs (5 pins), STLINK-V3EC (CN5.10 R91.2 U23.1)
PA0: Connectors (CN11.28 SB73.1), STM32_microcontroller_IOs (SB59.2 U14.34)
PA1: Connectors (CN11.30), STM32_microcontroller_IOs (SB58.1 U14.35)
PA2: Connectors (CN12.35), STM32_microcontroller_IOs (SB69.1 U14.36)
PA3: Connectors (CN10.34 CN12.37), STM32_microcontroller_IOs (U14.37)
PA4: Connectors (CN11.32), STM32_microcontroller_IOs (SB56.2 U14.40)
PA5: Connectors (CN7.10 CN12.11 SB51.1), STM32_microcontroller_IOs (U14.41)
PA6: Connectors (CN9.1 CN12.13), STM32_microcontroller_IOs (U14.42)
PA7: Connectors (CN12.15), STM32_microcontroller_IOs (SB38.1 U14.43)
PA8: Connectors (CN12.23), STM32_microcontroller_IOs (U14.100)
PA9: Connectors (CN12.21), STM32_microcontroller_IOs (SB31.2 U14.101)
PA10: Connectors (CN12.33), STM32_microcontroller_IOs (U14.102)
PA11: Connectors (SB21.2), STM32_microcontroller_IOs (SB27.1 U14.103)
PA12: Connectors (SB22.2), STM32_microcontroller_IOs (SB28.1 U14.104)
PA13: Connectors (CN11.13), STM32_microcontroller_IOs (U14.105)
PA14: Connectors (CN11.15), STM32_microcontroller_IOs (U14.109)
PA15: Connectors (CN7.9 CN11.17), STM32_microcontroller_IOs (U14.110)
PB0: Connectors (CN10.31 CN11.34 SB43.1), STM32_microcontroller_IOs (U14.46)
PB1: Connectors (CN9.7 CN12.24), STM32_microcontroller_IOs (U14.47)
PB2: Connectors (CN12.22 SB61.1 SB66.1), STM32_microcontroller_IOs (U14.48)
PB3: Connectors (CN12.31 SB33.1), STM32_microcontroller_IOs (SB39.2 U14.133)
PB4: Connectors (CN7.19 CN12.27), STM32_microcontroller_IOs (U14.134)
PB5: Connectors (CN12.29 SB17.1 SB41.2), STM32_microcontroller_IOs (U14.135)
PB6: Connectors (CN12.17), STM32_microcontroller_IOs (SB14.2 SB15.2 U14.136)
PB7: Connectors (CN11.21), STM32_microcontroller_IOs (SB40.2 SB63.1 U14.137)
PB8: Connectors (CN7.2 CN12.3 SB57.1), STM32_microcontroller_IOs (U14.139)
PB9: Connectors (CN7.4 CN12.5 SB52.1), STM32_microcontroller_IOs (U14.140)
PB10: Connectors (CN10.32 CN12.25), STM32_microcontroller_IOs (U14.69)
PB12: Connectors (CN7.7 CN12.16), STM32_microcontroller_IOs (U14.73)
PB13: Connectors (CN12.30 SB12.1), STM32_microcontroller_IOs (SB29.1 U14.74)
PB14: Connectors (CN12.28), STM32_microcontroller_IOs (SB30.1 U14.75)
PB15: Connectors (CN12.26 SB10.1), STM32_microcontroller_IOs (JP6.1 U14.76)
PC0: Connectors (CN9.3 CN11.38), STM32_microcontroller_IOs (U14.26)
PC1: Connectors (CN11.36), STM32_microcontroller_IOs (SB62.2 U14.27)
PC2: Connectors (CN11.35 SB53.1), STM32_microcontroller_IOs (U14.28)
PC3: Connectors (CN9.5 CN11.37), STM32_microcontroller_IOs (U14.29)
PC4: Connectors (CN12.34), STM32_microcontroller_IOs (SB42.2 U14.44)
PC5: Connectors (CN12.6), STM32_microcontroller_IOs (SB36.2 U14.45)
PC6: Connectors (CN7.1 CN12.4), STM32_microcontroller_IOs (U14.96)
PC7: Connectors (CN7.11 CN12.19), STM32_microcontroller_IOs (U14.97)
PC8: Connectors (CN8.2 SB19.2), STM32_microcontroller_IOs (U14.98)
PC9: Connectors (CN8.4 SB20.1), STM32_microcontroller_IOs (U14.99)
PC10: Connectors (CN8.6 CN11.1), STM32_microcontroller_IOs (U14.111)
PC11: Connectors (CN8.8 CN11.2), STM32_microcontroller_IOs (U14.112)
PC12: Connectors (CN8.10 CN11.3), STM32_microcontroller_IOs (U14.113)
PC13: Connectors (CN11.23), STM32_microcontroller_IOs (SB54.1 U14.7)
PC14: Connectors (CN11.25), STM32_microcontroller_IOs (SB45.1)
PC15: Connectors (CN11.27), STM32_microcontroller_IOs (SB44.1)
PD0: Connectors (CN9.25 CN11.57), STM32_microcontroller_IOs (U14.114)
PD1: Connectors (CN9.27 CN11.55), STM32_microcontroller_IOs (U14.115)
PD2: Connectors (CN8.12 CN11.4), STM32_microcontroller_IOs (U14.116)
PD3: Connectors (CN9.10 CN11.40), STM32_microcontroller_IOs (U14.117)
PD4: Connectors (CN9.8 CN11.39), STM32_microcontroller_IOs (U14.118)
PD5: Connectors (CN9.6 CN11.41), STM32_microcontroller_IOs (U14.119)
PD6: Connectors (CN9.4 CN11.43), STM32_microcontroller_IOs (U14.122)
PD7: Connectors (CN9.2 CN11.45), STM32_microcontroller_IOs (U14.123)
PD8: Connectors (SB13.2), STM32_microcontroller_IOs (SB23.1 SB24.1 U14.77)
PD9: Connectors (SB75.1), STM32_microcontroller_IOs (SB18.1 SB65.2 U14.78)
PD10: Connectors (CN12.65), STM32_microcontroller_IOs (U14.79)
PD11: Connectors (CN10.23 CN12.45), STM32_microcontroller_IOs (U14.80)
PD12: Connectors (CN10.21 CN12.43), STM32_microcontroller_IOs (U14.81)
PD13: Connectors (CN10.19 CN12.41), STM32_microcontroller_IOs (U14.82)
PD14: Connectors (CN7.16 CN12.46), STM32_microcontroller_IOs (U14.85)
PD15: Connectors (CN7.18 CN12.48), STM32_microcontroller_IOs (U14.86)
PE0: Connectors (CN10.33 CN12.64), STM32_microcontroller_IOs (U14.141)
PE2: Connectors (SB64.2 SB70.1), STM32_microcontroller_IOs (SB79.1 U14.1)
PE3: Connectors (SB78.2), STM32_microcontroller_IOs (SB80.1 U14.2)
PE4: Connectors (SB8.2), STM32_microcontroller_IOs (SB81.1 U14.3)
PE5: Connectors (SB9.2), STM32_microcontroller_IOs (SB82.1 U14.4)
PE6: Connectors (SB68.2 SB71.2), STM32_microcontroller_IOs (SB83.1 U14.5)
PE7: Connectors (CN10.20 CN12.44), STM32_microcontroller_IOs (U14.58)
PE8: Connectors (CN10.18 CN12.40), STM32_microcontroller_IOs (U14.59)
PE9: Connectors (CN12.52 SB35.2 SB67.1), STM32_microcontroller_IOs (U14.60)
PE10: Connectors (CN10.24 CN12.47), STM32_microcontroller_IOs (U14.63)
PE11: Connectors (CN10.6 CN12.56), STM32_microcontroller_IOs (U14.64)
PE12: Connectors (CN10.26 CN12.49), STM32_microcontroller_IOs (U14.65)
PE13: Connectors (CN10.10 CN12.55), STM32_microcontroller_IOs (U14.66)
PE14: Connectors (CN10.8 CN12.51), STM32_microcontroller_IOs (U14.67)
PE15: Connectors (CN10.30 CN12.53), STM32_microcontroller_IOs (U14.68)
PF0: Connectors (CN9.21 CN11.53), STM32_microcontroller_IOs (U14.10)
PF1: Connectors (CN9.19 CN11.51), STM32_microcontroller_IOs (U14.11)
PF2: Connectors (CN9.17 CN11.52), STM32_microcontroller_IOs (U14.12)
PF3: Connectors (CN7.20 CN12.58), STM32_microcontroller_IOs (U14.13)
PF4: Connectors (CN12.38 R68.1), STM32_microcontroller_IOs (U14.14)
PF5: Connectors (CN12.36), STM32_microcontroller_IOs (U14.15)
PF6: Connectors (CN11.9), STM32_microcontroller_IOs (U14.18)
PF7: Connectors (CN9.26 CN11.11), STM32_microcontroller_IOs (U14.19)
PF8: Connectors (CN9.24 CN11.54), STM32_microcontroller_IOs (U14.20)
PF9: Connectors (CN9.28 CN11.56), STM32_microcontroller_IOs (U14.21)
PF10: Connectors (CN12.42), STM32_microcontroller_IOs (U14.22)
PF11: Connectors (CN12.62 SB60.1), STM32_microcontroller_IOs (U14.49)
PF12: Connectors (CN10.7 CN12.59), STM32_microcontroller_IOs (U14.50)
PF13: Connectors (CN10.9 CN12.57), STM32_microcontroller_IOs (U14.53)
PF14: Connectors (CN10.11 CN12.50), STM32_microcontroller_IOs (U14.54)
PF15: Connectors (CN12.60), STM32_microcontroller_IOs (U14.55)
PG0: Connectors (CN9.29 CN11.59), STM32_microcontroller_IOs (U14.56)
PG1: Connectors (CN9.30 CN11.58), STM32_microcontroller_IOs (U14.57)
PG2: Connectors (CN8.14 CN11.42), STM32_microcontroller_IOs (U14.87)
PG3: Connectors (CN8.16 CN11.44), STM32_microcontroller_IOs (U14.88)
PG4: Connectors (CN12.69 R69.1), STM32_microcontroller_IOs (U14.89)
PG5: Connectors (CN12.68), STM32_microcontroller_IOs (U14.90)
PG6: Connectors (CN10.13 CN12.70), STM32_microcontroller_IOs (U14.91)
PG7: Connectors (CN12.67), STM32_microcontroller_IOs (SB74.2 U14.92)
PG8: Connectors (CN12.66), STM32_microcontroller_IOs (U14.93)
PG9: Connectors (CN7.12 CN11.63), STM32_microcontroller_IOs (U14.124)
PG10: Connectors (CN7.17 CN11.66), STM32_microcontroller_IOs (U14.125)
PG11: Connectors (CN11.70), STM32_microcontroller_IOs (SB34.2 U14.126)
PG12: Connectors (CN10.2 CN11.65), STM32_microcontroller_IOs (U14.127)
PG13: Connectors (CN11.68), STM32_microcontroller_IOs (SB37.2 U14.128)
PG14: Connectors (CN10.12 CN12.61), STM32_microcontroller_IOs (U14.129)
PG15: Connectors (CN11.64), STM32_microcontroller_IOs (U14.132)
PH0: Connectors (CN11.29), STM32_microcontroller_IOs (SB50.2)
PH1: Connectors (CN11.31), STM32_microcontroller_IOs (SB48.2)
RMII_CRS_DV: Ethernet (R37.1), STM32_microcontroller_IOs (SB38.2)
RMII_MDC: Ethernet (U15.13), STM32_microcontroller_IOs (SB62.1)
RMII_MDIO: Ethernet (R43.1 U15.12), STM32_microcontroller_IOs (SB69.2)
RMII_REF_CLK: Ethernet (R45.1), STM32_microcontroller_IOs (SB58.2)
RMII_RXD0: Ethernet (R40.1), STM32_microcontroller_IOs (SB42.1)
RMII_RXD1: Ethernet (R41.1), STM32_microcontroller_IOs (SB36.1)
RMII_TX_EN: Ethernet (U15.16), STM32_microcontroller_IOs (SB34.1)
RMII_TXD0: Ethernet (U15.17), STM32_microcontroller_IOs (SB37.1)
RMII_TXD1: Ethernet (U15.18), STM32_microcontroller_IOs (JP6.2)
STLK_MCO: STM32_microcontroller_IOs (SB49.2), STLINK-V3EC (C35.1 R77.2)
T_VCP_RX: STM32_microcontroller_IOs (SB18.2 SB40.1), STLINK-V3EC (R82.2)
T_VCP_TX: STM32_microcontroller_IOs (SB15.1 SB24.2), STLINK-V3EC (R20.1 U10.12)
TRACE_CK: STM32_microcontroller_IOs (SB79.2), STLINK-V3EC (R89.2)
TRACE_D0: STM32_microcontroller_IOs (SB80.2), STLINK-V3EC (R97.2)
TRACE_D1: STM32_microcontroller_IOs (SB81.2), STLINK-V3EC (R98.2)
TRACE_D2: STM32_microcontroller_IOs (SB82.2), STLINK-V3EC (R99.2)
TRACE_D3: STM32_microcontroller_IOs (SB83.2), STLINK-V3EC (R100.2)
UCPD_CC1: USB (SB6.1 U18.3), STM32_microcontroller_IOs (SB29.2)
UCPD_CC2: USB (SB5.1 U18.1), STM32_microcontroller_IOs (SB30.2)
UCPD_DBn: USB (U18.10), STM32_microcontroller_IOs (SB31.1)
UCPD_FLT: USB (R50.2 U18.11), STM32_microcontroller_IOs (SB74.1)
USB_FS_N: USB (CN13.A7 CN13.B7 U19.1 U19.6), STM32_microcontroller_IOs (SB27.2)
USB_FS_P: USB (CN13.A6 CN13.B6 U19.3 U19.4), STM32_microcontroller_IOs (SB28.2)
VBUS_SENSE: USB (C85.2 R48.2 R49.1), STM32_microcontroller_IOs (SB56.1)

## Assembly variants
H563ZI: not fitted C36 C37 C63 C64 C90 C92 CN2 CN11 CN12 R2 R53 R54 R85 R86 R87 R88 R93 SB3 SB4 SB5 SB6 SB7 SB10 SB12 SB15 SB17 SB21 SB22 SB23 SB25 SB33 SB40 SB44 SB45 SB48 SB50 SB51 SB52 SB57 SB59 SB65 SB66 SB67 SB70 SB76 SB77 SB84 U8